# Altium schematic sheet SD Card Interface.SchDoc: Ravage - SD Card Interface
size A4; Address1: Drawn By:; Address2: Dan Visser; DocumentNumber: A; Revision: 0.1-alpha; SheetNumber: 14; SheetTotal: 16
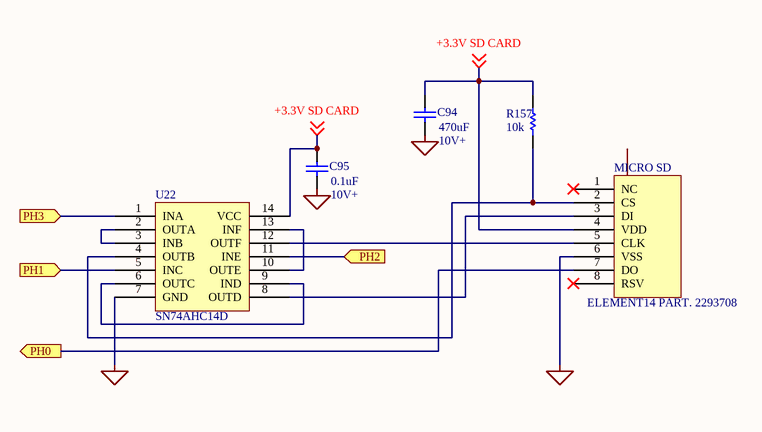
[diagram p0: SD Card Interface.SchDoc]

## Parts
C94  value 470uF  [RAD-0.3]
C95  value 0.1uF  [RAD-0.3]
MICRO_SD  ELEMENT14 PART. 2293708
R157  value 10k  [AXIAL-0.3]
U22  SN74AHC14D

## Ports
PH0 (out), PH1 (in), PH2 (in), PH3 (in)

## Nets
NetC94_1: C94.1 C95.1 MICRO_SD.6(VSS) U22.7(GND)
+3.3V SD CARD: C94.2 C95.2 MICRO_SD.4(VDD) R157.2 U22.14(VCC) ; off-sheet +3.3V SD CARD
PH0: MICRO_SD.7(DO) ; port PH0
PH1: U22.5(INC) ; port PH1
PH2: U22.11(INE) ; port PH2
PH3: U22.1(INA) ; port PH3
NetMICRO_SD_2: MICRO_SD.2(CS) R157.1 U22.4(OUTB)
NetMICRO_SD_3: MICRO_SD.3(DI) U22.8(OUTD)
NetMICRO_SD_5: MICRO_SD.5(CLK) U22.12(OUTF)
NetU22_2: U22.2(OUTA) U22.3(INB)
NetU22_6: U22.6(OUTC) U22.9(IND)
NetU22_10: U22.10(OUTE) U22.13(INF)

Not connected (* = marked no-connect by the designer): MICRO_SD 1(NC)* 8(RSV)*

## Notes on the sheet
- (near C94) 10V+
- (near C95) 10V+
- Title
- Size:
- Date:
- A4
- Number:
- Time:
- Revision:
- Sheet
- of

## Library data of the parts
C94 C95 = Cap: Capacitor; Published: 8-Jun-2000; LatestRevisionDate: 17-Jul-2002; LatestRevisionNote: Re-released for DXP Platform.; PackageReference: RAD-0.3; Publisher: Altium Limited; PackageDescription: Radial Cap, Thru-Hole; 2 Leads; 0.3 in Pin Spacing
MICRO_SD = ELEMENT14 PART. 1764377
R157 = Res1: Resistor; Published: 8-Jun-2000; LatestRevisionDate: 17-Jul-2002; LatestRevisionNote: Re-released for DXP Platform.; PackageReference: AXIAL-0.3; Publisher: Altium Limited; PackageDescription: Axial Device, Thru-Hole; 2 Leads; 0.3 in Pin Spacing
U22 = SN74AHC14N